# Altium schematic sheet PCB_Node_breakout.SchDoc
size A4
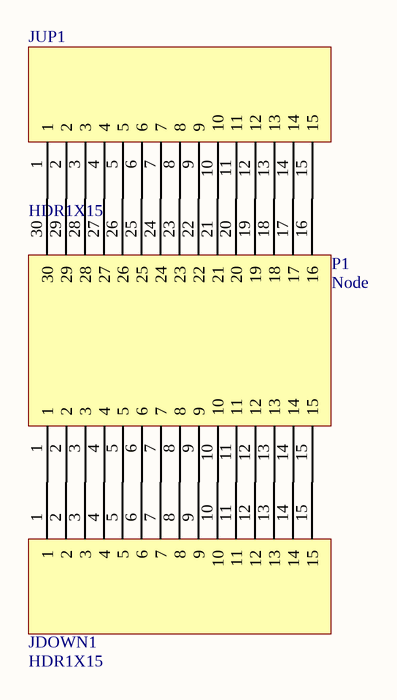
[diagram p0: PCB_Node_breakout.SchDoc]

## Parts
JDOWN1  HDR1X15  [HDR1X15]
JUP1  HDR1X15  [HDR1X15]
P1  Node  [NodePatten]

## Nets
NetJDOWN1_1: JDOWN1.1 P1.1
NetJDOWN1_2: JDOWN1.2 P1.2
NetJDOWN1_3: JDOWN1.3 P1.3
NetJDOWN1_4: JDOWN1.4 P1.4
NetJDOWN1_5: JDOWN1.5 P1.5
NetJDOWN1_6: JDOWN1.6 P1.6
NetJDOWN1_7: JDOWN1.7 P1.7
NetJDOWN1_8: JDOWN1.8 P1.8
NetJDOWN1_9: JDOWN1.9 P1.9
NetJDOWN1_10: JDOWN1.10 P1.10
NetJDOWN1_11: JDOWN1.11 P1.11
NetJDOWN1_12: JDOWN1.12 P1.12
NetJDOWN1_13: JDOWN1.13 P1.13
NetJDOWN1_14: JDOWN1.14 P1.14
NetJDOWN1_15: JDOWN1.15 P1.15
NetJUP1_1: JUP1.1 P1.30
NetJUP1_2: JUP1.2 P1.29
NetJUP1_3: JUP1.3 P1.28
NetJUP1_4: JUP1.4 P1.27
NetJUP1_5: JUP1.5 P1.26
NetJUP1_6: JUP1.6 P1.25
NetJUP1_7: JUP1.7 P1.24
NetJUP1_8: JUP1.8 P1.23
NetJUP1_9: JUP1.9 P1.22
NetJUP1_10: JUP1.10 P1.21
NetJUP1_11: JUP1.11 P1.20
NetJUP1_12: JUP1.12 P1.19
NetJUP1_13: JUP1.13 P1.18
NetJUP1_14: JUP1.14 P1.17
NetJUP1_15: JUP1.15 P1.16

## Library data of the parts
P1 = NodePatten